# Altium schematic sheet ADS8588.SchDoc
size A3 portrait; SheetNumber: 4; SheetTotal: 6
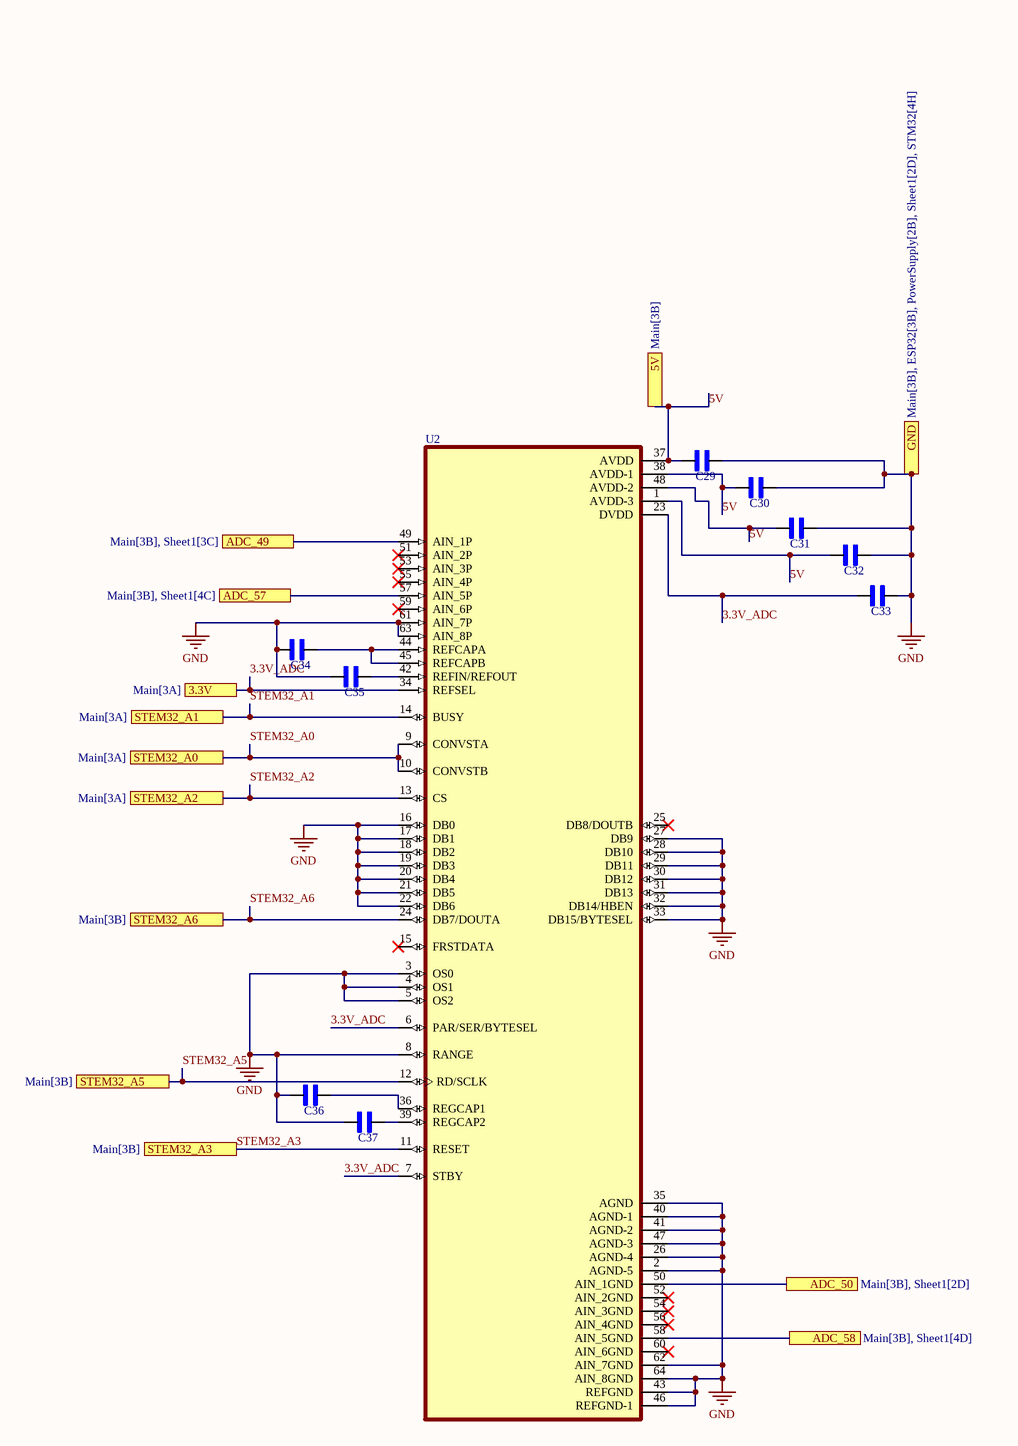
[diagram p0: ADS8588.SchDoc]

## Parts
C29  CAP603  [CAP603]  (value not drawn)
C30  CAP603  [CAP603]  (value not drawn)
C31  CAP603  [CAP603]  (value not drawn)
C32  CAP603  [CAP603]  (value not drawn)
C33  CAP603  [CAP603]  (value not drawn)
C34  CAP603  [CAP603]  (value not drawn)
C35  CAP603  [CAP603]  (value not drawn)
C36  CAP603  [CAP603]  (value not drawn)
C37  CAP603  [CAP603]  (value not drawn)
U2  ADS8588SIPM  [ADS8588SIPM]  (value not drawn)

## Ports
3.3V (see Main[3A]), 5V (see Main[3B]), ADC_49 (see Main[3B], Sheet1[3C]), ADC_50 (see Main[3B], Sheet1[2D]), ADC_57 (see Main[3B], Sheet1[4C]), ADC_58 (see Main[3B], Sheet1[4D]), GND (see Main[3B], ESP32[3B], PowerSupply[2B], Sheet1[2D], STM32[4H]), STEM32_A0 (see Main[3A]), STEM32_A1 (see Main[3A]), STEM32_A2 (see Main[3A]), STEM32_A3 (see Main[3B]), STEM32_A5 (see Main[3B]), STEM32_A6 (see Main[3B])

## Nets
GND: C29.2 C30.2 C31.2 C32.2 C33.2 C34.1 C35.1 C36.1 C37.1 U2.2(AGND-5) U2.3(OS0) U2.4(OS1) U2.5(OS2) U2.8(RANGE) U2.16(DB0) U2.17(DB1) U2.18(DB2) U2.19(DB3) U2.20(DB4) U2.21(DB5) U2.22(DB6) U2.26(AGND-4) U2.27(DB9) U2.28(DB10) U2.29(DB11) U2.30(DB12) U2.31(DB13) U2.32(DB14/HBEN) U2.33(DB15/BYTESEL) U2.35(AGND) U2.40(AGND-1) U2.41(AGND-2) U2.43(REFGND) U2.46(REFGND-1) U2.47(AGND-3) U2.61(AIN_7P) U2.62(AIN_7GND) U2.63(AIN_8P) U2.64(AIN_8GND) ; port GND
3.3V_ADC: C33.1 U2.6(PAR/SER/BYTESEL) U2.7(STBY) U2.23(DVDD) U2.34(REFSEL) ; port 3.3V
5V: C29.1 C30.1 C31.1 C32.1 U2.1(AVDD-3) U2.37(AVDD) U2.38(AVDD-1) U2.48(AVDD-2) ; port 5V
ADC_49: U2.49(AIN_1P) ; port ADC_49
ADC_50: U2.50(AIN_1GND) ; port ADC_50
ADC_57: U2.57(AIN_5P) ; port ADC_57
ADC_58: U2.58(AIN_5GND) ; port ADC_58
STEM32_A0: U2.9(CONVSTA) U2.10(CONVSTB) ; port STEM32_A0
STEM32_A1: U2.14(BUSY) ; port STEM32_A1
STEM32_A2: U2.13(CS) ; port STEM32_A2
STEM32_A3: U2.11(RESET) ; port STEM32_A3
STEM32_A5: U2.12(RD/SCLK) ; port STEM32_A5
STEM32_A6: U2.24(DB7/DOUTA) ; port STEM32_A6
NetC34_2: C34.2 U2.44(REFCAPA) U2.45(REFCAPB)
NetC35_2: C35.2 U2.42(REFIN/REFOUT)
NetC36_2: C36.2 U2.36(REGCAP1)
NetC37_2: C37.2 U2.39(REGCAP2)

Not connected (* = marked no-connect by the designer): U2 15(FRSTDATA)* 25(DB8/DOUTB)* 51(AIN_2P)* 52(AIN_2GND)* 53(AIN_3P)* 54(AIN_3GND)* 55(AIN_4P)* 56(AIN_4GND)* 59(AIN_6P)* 60(AIN_6GND)*

## Notes on the sheet
- Title
- Size:
- Date:
- A3
- Number:
- Time:
- Revision:
- Sheet
- of
- File:

## Library data of the parts
C29-C37 = CAP603: 0.1 ÂµF Â±5% 10V Ceramic Capacitor X7R 0603 (1608 Metric); MF: Vishay; MP: VJ0603Y104JXQCW1BC; SnapEDA_Link: https://www.snapeda.com/parts/VJ0603Y104JXQCW1BC/Vishay/view-part/?ref=snap; Package: 0603-2 VISHAY; Value: *; Check_prices: https://www.snapeda.com/parts/VJ0603Y104JXQCW1BC/Vishay/view-part/?ref=eda
U2 = ADS8588SIPM: 16-Bit High-Speed 8-Channel Simultaneous-Sampling ADC With Bipolar Inputs on a Single Supply 64-LQFP -40 to 125; MF: Texas Instruments; Value: *; SnapEDA_Link: https://www.snapeda.com/parts/ADS8588SIPM/Texas+Instruments/view-part/?ref=snap; Purchase-URL: https://pricing.snapeda.com/search/part/ADS8588SIPM/?ref=eda; Availability: In Stock; Price: None; Package: LQFP-64 Texas Instruments; Check_prices: https://www.snapeda.com/parts/ADS8588SIPM/Texas+Instruments/view-part/?ref=eda; MP: ADS8588SIPM